# Altium schematic sheet Power supply.SchDoc
size A4; Organization: Altium Limited; Address1: 3 Minna Close; Address2: Belrose; Address3: NSW 2085; Address4: Australia
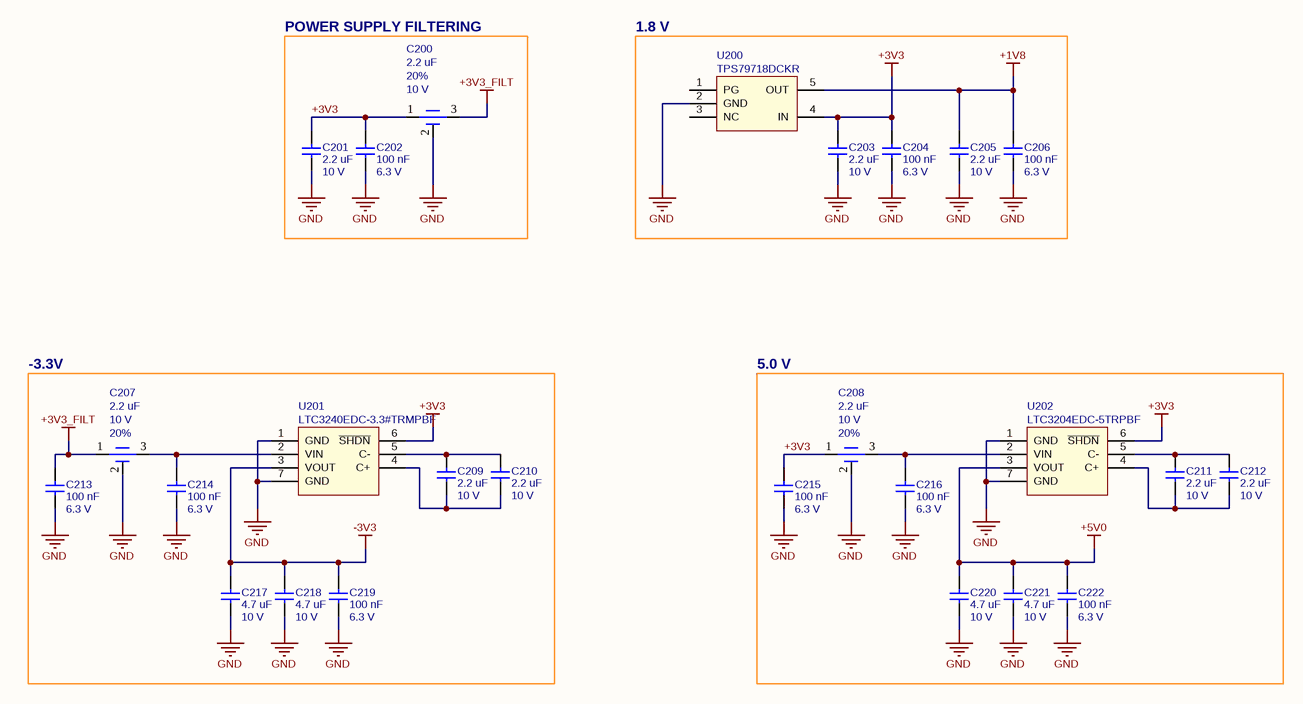
[diagram p0: Power supply.SchDoc]

## Parts
C200  value 2.2 uF  Tolerance: 20%  Voltage Max: 10 V  [NFC18PC - 0603]  (hidden comment: NFM18PC225B1A3)
C201  value 2.2 uF  Voltage Max: 10 V  [C0201]  (hidden comment: Capacitor no polarized)
C202  value 100 nF  Voltage Max: 6.3 V  [C0201]  (hidden comment: Capacitor no polarized)
C203  value 2.2 uF  Voltage Max: 10 V  [C0402]  (hidden comment: Capacitor no polarized)
C204  value 100 nF  Voltage Max: 6.3 V  [C0201]  (hidden comment: Capacitor no polarized)
C205  value 2.2 uF  Voltage Max: 10 V  [C0402]  (hidden comment: Capacitor no polarized)
C206  value 100 nF  Voltage Max: 6.3 V  [C0201]  (hidden comment: Capacitor no polarized)
C207  value 2.2 uF  Tolerance: 20%  Voltage Max: 10 V  [NFC18PC - 0603]  (hidden comment: NFM18PC225B1A3)
C208  value 2.2 uF  Tolerance: 20%  Voltage Max: 10 V  [NFC18PC - 0603]  (hidden comment: NFM18PC225B1A3)
C209  value 2.2 uF  Voltage Max: 10 V  [C0201]  (hidden comment: Capacitor no polarized)
C210  value 2.2 uF  Voltage Max: 10 V  [C0201]  (hidden comment: Capacitor no polarized)
C211  value 2.2 uF  Voltage Max: 10 V  [C0201]  (hidden comment: Capacitor no polarized)
C212  value 2.2 uF  Voltage Max: 10 V  [C0201]  (hidden comment: Capacitor no polarized)
C213  value 100 nF  Voltage Max: 6.3 V  [C0201]  (hidden comment: Capacitor no polarized)
C214  value 100 nF  Voltage Max: 6.3 V  [C0201]  (hidden comment: Capacitor no polarized)
C215  value 100 nF  Voltage Max: 6.3 V  [C0201]  (hidden comment: Capacitor no polarized)
C216  value 100 nF  Voltage Max: 6.3 V  [C0201]  (hidden comment: Capacitor no polarized)
C217  value 4.7 uF  Voltage Max: 10 V  [C0402]  (hidden comment: Capacitor no polarized)
C218  value 4.7 uF  Voltage Max: 10 V  [C0402]  (hidden comment: Capacitor no polarized)
C219  value 100 nF  Voltage Max: 6.3 V  [C0201]  (hidden comment: Capacitor no polarized)
C220  value 4.7 uF  Voltage Max: 10 V  [C0402]  (hidden comment: Capacitor no polarized)
C221  value 4.7 uF  Voltage Max: 10 V  [C0402]  (hidden comment: Capacitor no polarized)
C222  value 100 nF  Voltage Max: 6.3 V  [C0201]  (hidden comment: Capacitor no polarized)
U200  Reference: TPS79718DCKR  [5-SC70]  (hidden comment: TPS79718DCK)
U201  Reference: LTC3240EDC-3.3#TRMPBF  [DFN-6_DC]  (hidden comment: LTC3204-5)
U202  Reference: LTC3204EDC-5TRPBF  [DFN-6_DC]  (hidden comment: LTC3204-5)

## Blocks framed on the sheet
POWER SUPPLY FILTERING: C200-C202
1.8 V: C203-C206 U200
-3.3V: C207 C209 C210 C213 C214 C217-C219 U201
5.0 V: C208 C211 C212 C215 C216 C220-C222 U202

## Nets
+1V8: C205.2 C206.2 U200.5(OUT)
+3V3: C200.1(IN) C201.2 C202.2 C203.2 C204.2 C208.1(IN) C215.2 U200.4(IN) U201.6(~{SHDN}) U202.6(~{SHDN})
+3V3_FILT: C200.3(OUT) C207.1(IN) C213.2
+5V0: C220.2 C221.2 C222.2 U202.3(VOUT)
-3V3: C217.2 C218.2 C219.2 U201.3(VOUT)
GND: C200.2(GND) C201.1 C202.1 C203.1 C204.1 C205.1 C206.1 C207.2(GND) C208.2(GND) C213.1 C214.1 C215.1 C216.1 C217.1 C218.1 C219.1 C220.1 C221.1 C222.1 U200.2(GND) U201.1(GND) U201.7(GND) U202.1(GND) U202.7(GND)
NetC207_3: C207.3(OUT) C214.2 U201.2(VIN)
NetC208_3: C208.3(OUT) C216.2 U202.2(VIN)
NetC209_1: C209.1 C210.1 U201.4(C+)
NetC209_2: C209.2 C210.2 U201.5(C-)
NetC211_1: C211.1 C212.1 U202.4(C+)
NetC211_2: C211.2 C212.2 U202.5(C-)

Not connected (* = marked no-connect by the designer): U200 1(PG) 3(NC)

## Notes on the sheet
- Title
- Size:
- Date:
- A4
- Number:
- Time:
- Revision:
- Sheet
- of
- File:

## Library data of the parts
C200 C207 C208 = NFM18PC225B1A3: 3 Terminal Low ESL Chip Multilayer Ceramic Capacitor; Manufacturer: Murata; Current Max: 4 A; ESR: 0.01 Ohm; Component URL: https://psearch.en.murata.com/capacitor/product/NFM18PC225B1A3%23.html?excid=ww_pa-o_ow_ctl_c02e-21_2017; Dielectric: *; Package: 0603; Package Description: 3 Lead capacitor; Power Max: *; Supplier 1: Mouser; Supplier 1 Part Number: 81-NFM18PC225B1A3D; Supplier 2: Farnell; Supplier 2 Part Number: 2470495; Supplier 3: Digikey; Supplier 3 Part Number: 490-6972-1-ND; Voltage Min: *; Voltage Typ: *; Reference: NFM18PC225B1A3
C201 C203 C205 C209-C212 = Capacitor no polarized: Generic Capacitor; Manufacturer: Murata; Dielectric: X5R; Tolerance: 10%; Reference: GRM033R61A225KE47D; Component URL: https://product.tdk.com/en/search/capacitor/ceramic/mlcc/info?part_no=C1608X5R0J156M080AC; Current Max: *; Package: 0201; Package Description: *; Power Max: *; Supplier 1: Mouser; Supplier 2: Farnell; Supplier 3: Digikey; Supplier 1 Part Number: 81-GRM033R61A225KE7D; Supplier 2 Part Number: 3581639; Supplier 3 Part Number: 490-13227-1-ND; ESR: *; Voltage Min: *; Voltage Typ: *
C202 C204 C206 C213-C216 C219 C222 = Capacitor no polarized: Generic Capacitor; Manufacturer: Murata; Dielectric: X5R; Tolerance: 10%; Reference: GMD033R60J104KE11D; Component URL: https://product.tdk.com/en/search/capacitor/ceramic/mlcc/info?part_no=C1608X5R0J156M080AC; Current Max: *; Package: 0201; Package Description: *; Power Max: *; Supplier 1: Mouser; Supplier 2: Farnell; Supplier 3: Digikey; Supplier 1 Part Number: 81-GMD033R60J104KE1D; Supplier 2 Part Number: 1657913; Supplier 3 Part Number: 490-14513-1-ND; ESR: *; Voltage Min: *; Voltage Typ: *
C217 C218 C220 C221 = Capacitor no polarized: Generic Capacitor; Manufacturer: Murata; Dielectric: X5R; Tolerance: 10%; Reference: ZRB157R61A225KE11D; Component URL: https://product.tdk.com/en/search/capacitor/ceramic/mlcc/info?part_no=C1608X5R0J156M080AC; Current Max: *; Package: 0402; Package Description: *; Power Max: *; Supplier 1: Mouser; Supplier 2: Farnell; Supplier 3: Digikey; Supplier 1 Part Number: 81-ZRB157R61A225KE11D; Supplier 2 Part Number: 2990838; Supplier 3 Part Number: 490-10980-1-ND; ESR: *; Voltage Min: *; Voltage Typ: *
U200 = TPS79718DCK: Ultra-low Iq 50-mA low-dropout linear regulator with power good output in SC-70 package; Manufacturer: Texas Instruments; Voltage Max: 5.5 V; Voltage Min: 1.8 V; Current Max: 0.100 A; Component URL: https://www.ti.com/store/ti/en/p/product/?p=TPS79718DCKR&keyMatch=TPS79718DCKR&tisearch=Search-EN-everything&usecase=OPN; Supplier 1: Mouser; Supplier 2: Farnell; Supplier 3: Digikey; Supplier 1 Part Number: 595-TPS79718DCKR; Supplier 2 Part Number: 1575753; Supplier 3 Part Number: 296-11988-1-ND; Voltage Typ: *; Value: *; Tolerance: *; Footprint Description: 5-Lead Small; ESR: *; Power Max: *
U201 U202 = LTC3204-5: Low noise regulated charge pump in 2 x 2 DFN; Manufacturer: Analog Devices; Current Max: 0.150 A; Voltage Max: 5.5 V; Voltage Min: 2.7 V; ESR: *; Footprint: 6-DFN; Footprint Description: 6-Lead Plastic DFN; Supplier 1: Mouser; Supplier 2: Farnell; Supplier 3: Digikey; Voltage Typ: *; Tolerance: *; Value: *; Power Max: *
  U201: Component URL: https://www.analog.com/en/products/ltc3240.html; Supplier 1 Part Number: 584-C3240EDC-3.3TMPF; Supplier 2 Part Number: 1715233; Supplier 3 Part Number: LTC3240EDC-3.3#TRMPBFCT-ND
  U202: Component URL: https://www.analog.com/en/products/ltc3204.html; Supplier 1 Part Number: 584-C3204EDC-5TRPBF; Supplier 2 Part Number: *; Supplier 3 Part Number: LTC3204EDC-5#TRPBF-ND